# Altium project PCB_Robo_Hand.PrjPcb
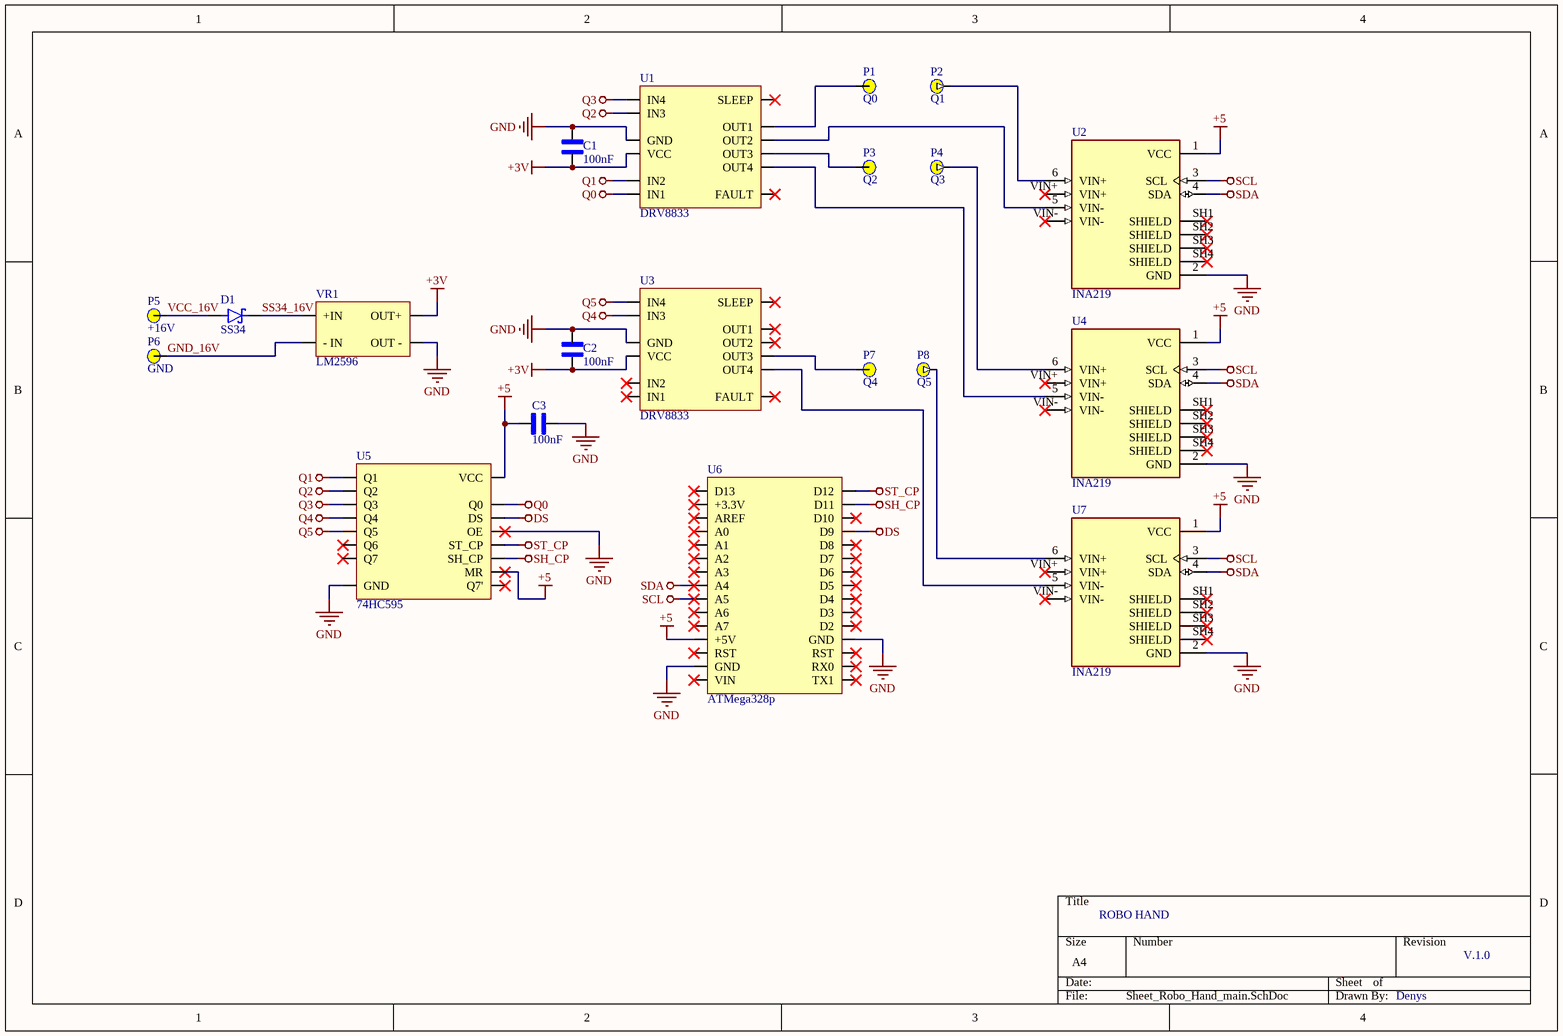
[diagram p0: Sheet_Robo_Hand_main.SchDoc]
1 sheet, 20 parts. Net scope: global (net labels, ports and power ports of the same name join across sheets).
Board file: PCB_Robo_Hand.PcbDoc

## Sheet Sheet_Robo_Hand_main.SchDoc
size A4; SheetNumber: 1; SheetTotal: 1

### Parts
C1  100nF  [CAPC3216X180N]  (no BOM)
C2  100nF  [CAPC3216X180N]  (no BOM)
C3  100nF  [CAPC3216X180N]  (no BOM)
D1  SS34  [DIOM7959X265N]  (no BOM)
P1  Q0  [PCB_Pin_1]  (no BOM)
P2  Q1  [PCB_Pin_1]  (no BOM)
P3  Q2  [PCB_Pin_1]  (no BOM)
P4  Q3  [PCB_Pin_1]  (no BOM)
P5  +16V  [PCB_Pin_1]  (no BOM)
P6  GND  [PCB_Pin_1]  (no BOM)
P7  Q4  [PCB_Pin_1]  (no BOM)
P8  Q5  [PCB_Pin_1]  (no BOM)
U1  DRV8833  [PCB_DRV8833]  (no BOM)
U2  INA219  [MODULE_INA219]
U3  DRV8833  [PCB_DRV8833]  (no BOM)
U4  INA219  [MODULE_INA219]
U5  74HC595  [PCB_74HC595_Footprint]  (no BOM)
U6  ATMega328p  [PCB_ATMega328p]  (no BOM)
U7  INA219  [MODULE_INA219]
VR1  LM2596  [DC-DC Step-Down Footprint]  (no BOM)

### Nets
+3V: C1.2 C2.1 U1.2(VCC) U3.2(VCC) VR1.2(OUT+)
+5: C3.2 U2.1(VCC) U4.1(VCC) U5.8(VCC) U5.14(MR) U6.3(+5V) U7.1(VCC)
DS: U5.10(DS) U6.18(D9)
GND: C1.1 C2.2 C3.1 U1.3(GND) U2.2(GND) U3.3(GND) U4.2(GND) U5.0(GND) U5.11(OE) U6.1(GND) U6.26(GND) U7.2(GND) VR1.3(OUT_-)
Q0: U1.0(IN1) U5.9(Q0)
Q1: U1.1(IN2) U5.7(Q1)
Q2: U1.4(IN3) U5.6(Q2)
Q3: U1.5(IN4) U5.5(Q3)
Q4: U3.4(IN3) U5.4(Q4)
Q5: U3.5(IN4) U5.3(Q5)
SCL: U2.3(SCL) U4.3(SCL) U6.6(A5) U7.3(SCL)
SDA: U2.4(SDA) U4.4(SDA) U6.7(A4) U7.4(SDA)
SH_CP: U5.13(SH_CP) U6.16(D11)
ST_CP: U5.12(ST_CP) U6.15(D12)
GND_16V: P6.0(Pin) VR1.0(-_IN)
SS34_16V: D1.C(K) VR1.1(+IN)
VCC_16V: D1.A P5.0(Pin)
NetP1_0: P1.0(Pin) U1.7(OUT1)
NetP2_0: P2.0(Pin) U2.6(VIN+)
NetP3_0: P3.0(Pin) U1.9(OUT3)
NetP4_0: P4.0(Pin) U4.6(VIN+)
NetP7_0: P7.0(Pin) U3.9(OUT3)
NetP8_0: P8.0(Pin) U7.6(VIN+)
NetU1_8: U1.8(OUT2) U2.5(VIN-)
NetU1_10: U1.10(OUT4) U4.5(VIN-)
NetU3_10: U3.10(OUT4) U7.5(VIN-)

Not connected (* = marked no-connect by the designer): U1 6(SLEEP)* 11(FAULT)*; U2 SH1(SHIELD)* SH2(SHIELD)* SH3(SHIELD)* SH4(SHIELD)* VIN+* VIN-*; U3 0(IN1)* 1(IN2)* 6(SLEEP)* 7(OUT1)* 8(OUT2)* 11(FAULT)*; U4 SH1(SHIELD)* SH2(SHIELD)* SH3(SHIELD)* SH4(SHIELD)* VIN+* VIN-*; U5 1(Q7)* 2(Q6)* 15(Q7')*; U6 0(VIN)* 2(RST)* 4(A7)* 5(A6)* 8(A3)* 9(A2)* 10(A1)* 11(A0)* 12(AREF)* 13(+3.3V)* 14(D13)* 17(D10)* 19(D8)* 20(D7)* 21(D6)* 22(D5)* 23(D4)* 24(D3)* 25(D2)* 27(RST)* 28(RX0)* 29(TX1)*; U7 SH1(SHIELD)* SH2(SHIELD)* SH3(SHIELD)* SH4(SHIELD)* VIN+* VIN-*

### Notes on the sheet
- ROBO HAND
- V.1.0
- Denys

### Library data of the parts
C1-C3 = C_1206_100nF: Ceramic capacitor SMD 1206 100 nF 50 V 10 % Samsung Electro-Mechanics CL31B104KBCNNNC 4000 pc(s); MP: CL31B104KBCNNNC; SnapEDA_Link: https://www.snapeda.com/parts/CL31B104KBCNNNC/Samsung+Electro-Mechanics/view-part/?ref=snap; Availability: In Stock; MF: Samsung Electro-Mechanics; Package: 1206 Samsung; Check_prices: https://www.snapeda.com/parts/CL31B104KBCNNNC/Samsung+Electro-Mechanics/view-part/?ref=eda; Value: *; Purchase-URL: https://pricing.snapeda.com/search/part/CL31B104KBCNNNC/?ref=eda; Price: None
D1 = Diode_SS34: SS34 - діод Шоттки; MF: onsemi; SnapEDA_Link: https://www.snapeda.com/parts/SS34/Onsemi/view-part/?ref=snap; Package: SMC-2 ON Semiconductor; Value: *; MP: SS34; Check_prices: https://www.snapeda.com/parts/SS34/Onsemi/view-part/?ref=eda
P1-P8 = PIN_1
U1 U3 = Motor Driver: Драйвер крокового/колекторних двигунів DRV8833
U2 U4 U7 = INA219: INA219 High Side DC Current Sensor Breakout - 26V Â±3.2A Max ¦ Adafruit Industries 904; MP: INA219 High Side DC Current Sensor Breakout - 26V Â±3.2A Max - STEMMA QT; SnapEDA_Link: https://www.snapeda.com/parts/INA219%20High%20Side%20DC%20Current%20Sensor%20Breakout%20-%2026V%20%C2%B13.2A%20Max%20-%20STEMMA%20QT/Adafruit+Industries/view-part/?ref=snap; Package: NON-STANDARD-8 ADAFRUIT; Value: *; MF: Adafruit Industries; Check_prices: https://www.snapeda.com/parts/INA219%20High%20Side%20DC%20Current%20Sensor%20Breakout%20-%2026V%20%C2%B13.2A%20Max%20-%20STEMMA%20QT/Adafruit+Industries/view-part/?ref=eda
U5 = SCS-16: SN74HC595N - вихідний зсувний регістр 74HC595
U6 = Arduino Nano: DCCduino Nano CH340 - аналог Arduino Nano v3.0 TYPE C
VR1 = DC-DC Step-Down: DC-DC конвертер знижуючий 4.5...40В на 1.5...35В на LM2596